# EAGLE design t10 arduino prog (EAGLE 6.1)
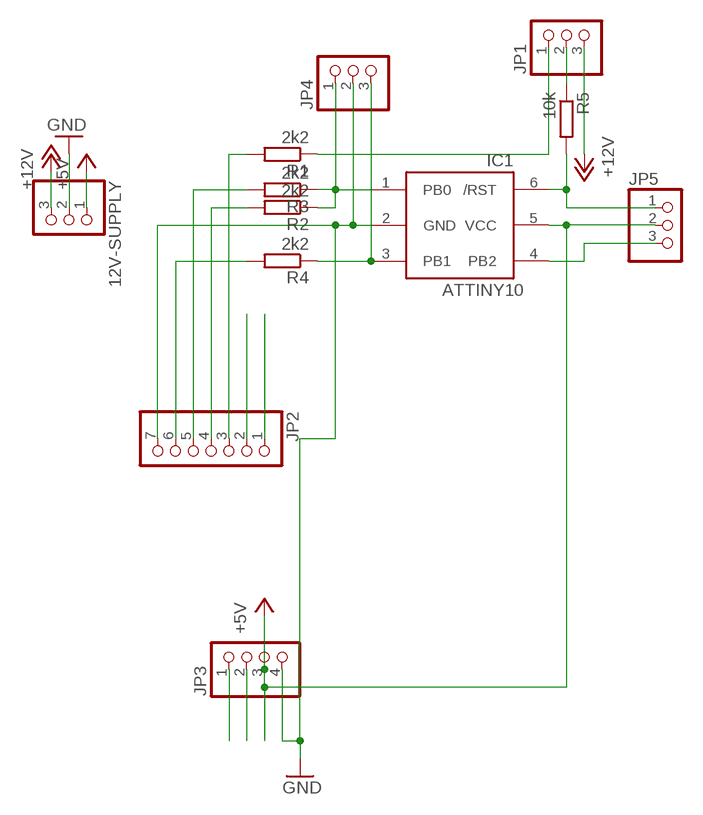
[diagram p0: schematic, sheet 1]

## Parts
12V-SUPPLY  PINHD-1X3/90  [1X03/90]
IC1  ATTINY10  [SOT23-6]
JP1  PINHD-1X3  [1X03]
JP2  PINHD-1X7  [1X07]
JP3  PINHD-1X4  [1X04]
JP4  PINHD-1X3  [1X03]
JP5  PINHD-1X3  [1X03]
R1  2k2  R-EU_0207/2V  [0207/2V]
R2  2k2  R-EU_0207/2V  [0207/2V]
R3  2k2  R-EU_0207/2V  [0207/2V]
R4  2k2  R-EU_0207/2V  [0207/2V]
R5  10k  R-EU_0207/2V  [0207/2V]

## Nets
+5V: 12V-SUPPLY.1 IC1.5(VCC) JP3.3 JP5.2
+12V: 12V-SUPPLY.3 JP1.3
GND: 12V-SUPPLY.2 IC1.2(GND) JP2.7 JP3.4 JP4.2
N$1: JP1.2 R5.1
N$2: JP2.2
N$3: JP2.1
N$4: JP3.1
N$5: JP2.3 R1.2
N$6: JP2.4 R2.2
N$7: JP2.5 R3.2
N$8: JP2.6 R4.2
N$9: IC1.1(PB0) JP4.1 R2.1 R3.1
N$10: IC1.3(PB1) JP4.3 R4.1
N$11: JP1.1 R1.1
N$12: IC1.6(/RST) JP5.1 R5.2
N$13: JP3.2
N$14: IC1.4(PB2) JP5.3

## Library data of the parts
12V-SUPPLY JP1 JP4 JP5 = pinhead:PINHD-1X3: PIN HEADER
IC1 = adafruit:ATTINY10: ATtiny4/5/9/10 8-bit Microcontroller with 512/1024 Bytes In-System Programmable Flash
JP2 = pinhead:PINHD-1X7: PIN HEADER
JP3 = pinhead:PINHD-1X4: PIN HEADER
R1-R5 = rcl:R-EU_: RESISTOR, European symbol

## Board
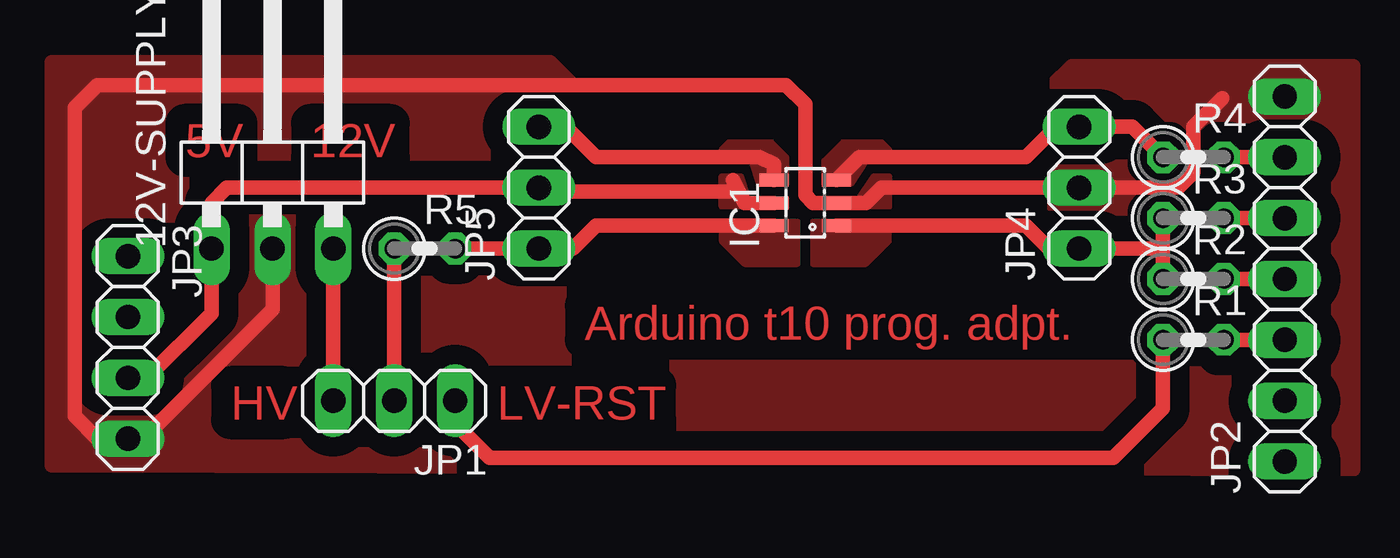
[diagram p1: board, top side]
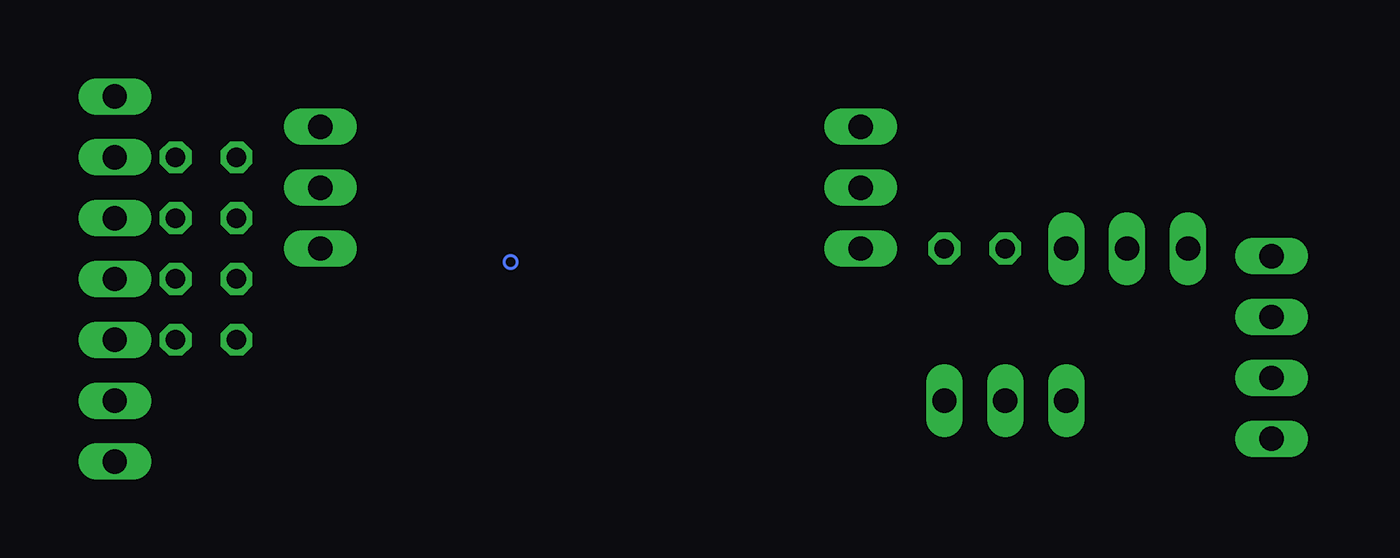
[diagram p2: board, bottom side, seen from below]

No outline drawn. Coordinates in mm, seen from the top.
Copper layers (1*16): Top 0.035mm / dielectric 1.5mm / Bottom 0.035mm
Design rules: minimum track width 10mil, minimum drill 24mil, track to track 8mil, track to pad 8mil, pad to pad 8mil, via to via 8mil, smd to smd 8mil, copper to edge 40mil, drill to drill 8mil, minimum pad ring 10mil, minimum via ring 8mil, stop-mask expansion 4mil, vias tented up to drill 0mil, thermal gap 10mil

### Footprints (pad centres in the part's own frame; a part is rotated, then mirrored left to right if it is on the bottom)
1X03/90 = drill 1.016 long: 1 -2.54,-3.81; 2 0,-3.81; 3 2.54,-3.81
SOT23-6 = smd 0.55 x 1.2: 1 -0.95,-1.3; 2 0,-1.3; 3 0.95,-1.3; 4 0.95,1.3; 5 0,1.3; 6 -0.95,1.3
1X03 = drill 1.016 long: 1 -2.54,0; 2 0,0; 3 2.54,0
1X07 = drill 1.016 long: 1 -7.62,0; 2 -5.08,0; 3 -2.54,0; 4 0,0; 5 2.54,0; 6 5.08,0; 7 7.62,0
1X04 = drill 1.016 long: 1 -3.81,0; 2 -1.27,0; 3 1.27,0; 4 3.81,0
0207/2V = drill 0.813 octagon: 1 -1.27,0; 2 1.27,0

### Placement (x,y rotation side)
12V-SUPPLY  17.14,39.69 0 top
IC1  39.37,37.78 90 top
JP1  22.23,29.53 180 top
JP2  59.37,34.61 90 top
JP3  11.11,31.75 270 top
JP4  50.8,38.42 90 top
JP5  28.26,38.42 90 top
R1  55.56,32.07 0 top
R2  55.56,34.61 0 top
R3  55.56,37.15 0 top
R4  55.56,39.69 0 top
R5  23.5,35.88 0 top

### Tracks (layer width: path | path; a pad name or v marks a point on that pad's centre or on a via)
+5V
  Top 0.61: IC1.5 36.83,37.78 36.35,38.73 | 36.2,38.26 29.53,38.26 29.37,38.42 JP5.2 15.24,38.42 14.61,37.78 12V-SUPPLY.1 14.61,33.18 11.91,30.48 JP3.3
  pour Top (no thermals): 38.58,37.94 38.58,37.62 35.88,37.62 35.88,38.89 36.67,38.89 36.99,37.94
+12V
  Top 0.61: 12V-SUPPLY.3 JP1.3
GND
  Top 0.61: IC1.2 41.91,37.78 42.55,38.42 JP4.2 54.93,38.42 55.56,39.05 55.56,40.96 56.77,42.16 | 40.64,37.78 39.69,37.78 39.37,38.1 39.37,41.91 38.58,42.7 9.84,42.7 8.89,41.75 8.89,28.89 9.84,27.94 JP3.4 | 10.95,27.94 JP3.4 | 12V-SUPPLY.2 17.14,33.34 11.75,27.94 JP3.4
  pour Top (no thermals): 40.32,37.94 41.59,37.94 42.23,38.89 42.86,38.89 42.86,37.62 40.32,37.62
  pour Top (isolate 0.813, no thermals): 7.94,43.66 28.73,43.66 29.69,42.7 29.69,32.86 30.48,32.07 49.21,32.07 49.85,32.7 49.69,42.7 50.48,43.5 62.23,43.5 62.23,26.67 7.94,26.83
N$1
  Top 0.61: JP1.2 R5.1
N$5
  Top 0.61: JP2.3 R1.2
N$6
  Top 0.61: JP2.4 R2.2
N$7
  Top 0.61: JP2.5 R3.2
N$8
  Top 0.61: JP2.6 R4.2
N$9
  Top 0.61: R3.1 54.29,36.83 | 54.29,36.83 54.29,35.88 | 54.29,35.88 R2.1 | 54.29,36.83 54.29,35.88 | 54.29,35.88 JP4.1 49.53,35.88 48.58,36.83 IC1.1
  pour Top (no thermals): 39.69,36.99 39.69,35.24 41.91,35.24 42.86,36.2 42.86,36.99
N$10
  Top 0.61: IC1.3 41.62,39.69 48.58,39.69 49.85,40.96 JP4.3 53.02,40.96 R4.1
  pour Top (no thermals): 42.86,39.53 41.91,39.53 41.27,38.58 40.16,38.58 40.16,39.53 40.96,40.32 42.55,40.32 42.86,40.01
N$11
  Top 0.61: JP1.1 24.77,28.57 26.19,27.15 52.23,27.15 54.29,29.21 R1.1
N$12
  Top 0.61: IC1.6 37.43,36.83 30.64,36.83 29.69,35.88 JP5.1 R5.2
  pour Top (no thermals): 39.05,36.99 35.88,36.99 35.88,36.2 36.83,35.24 39.05,35.24
N$14
  Top 0.61: IC1.4 38.07,39.4 37.47,39.69 30.64,39.69 29.37,40.96 JP5.3
  pour Top (no thermals): 37.47,38.58 37.15,39.53 35.88,39.53 35.88,40.01 36.2,40.32 37.94,40.32 38.58,39.69 38.58,38.58

### Text on the board
Top: 5V | 12V | Arduino t10 prog. adpt. | HV | LV-RST
Bottom: °